# EAGLE schematic LiPo Drop Charger (EAGLE 6.4)
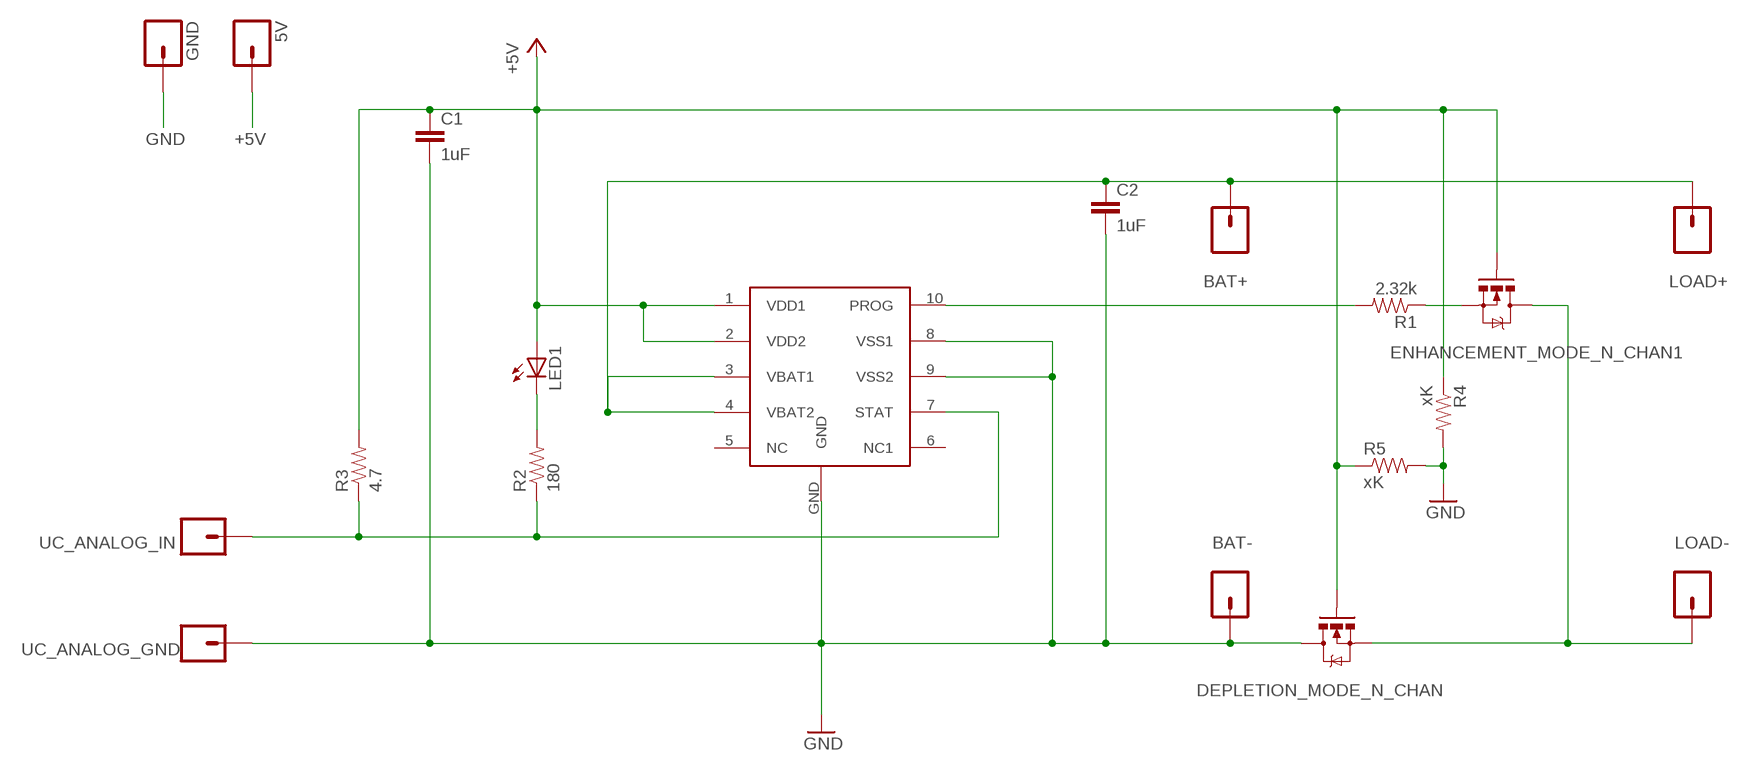
[diagram p0: schematic, sheet 1]

## Parts
5V  M01PTH  [1X01]
BAT+  M01PTH  [1X01]
BAT-  M01PTH  [1X01]
C1  1uF  CAP0805  [0805]
C2  1uF  CAP0805  [0805]
DEPLETION_MODE_N_CHAN  MOSFET-NCHANNELSMD  [SOT23-3]
ENHANCEMENT_MODE_N_CHAN1  MOSFET-NCHANNELSMD  [SOT23-3]
GND  M01PTH  [1X01]
LED1  LED0603  [LED-0603]
LOAD+  M01PTH  [1X01]
LOAD-  M01PTH  [1X01]
R1  2.32k  RESISTOR0805-RES  [0805]
R2  180  RESISTOR0805-RES  [0805]
R3  4.7  RESISTOR0805-RES  [0805]
R4  xK  RESISTOR0805-RES  [0805]
R5  xK  RESISTOR0805-RES  [0805]
U$1  MCP73213  [DFN10_3X3MM]
UC_ANALOG_GND  M01PTH  [1X01]
UC_ANALOG_IN  M01PTH  [1X01]

## Nets
+5V: 5V.1 C1.1 DEPLETION_MODE_N_CHAN.1(G) ENHANCEMENT_MODE_N_CHAN1.1(G) LED1.A R3.2 R4.1 R5.1 U$1.1(VDD1) U$1.2(VDD2)
GND: BAT-.1 C1.2 C2.2 DEPLETION_MODE_N_CHAN.3(D) GND.1 R4.2 R5.2 U$1.8(VSS1) U$1.9(VSS2) U$1.GND UC_ANALOG_GND.1
N$1: LED1.C R2.2
N$2: R2.1 R3.1 U$1.7(STAT) UC_ANALOG_IN.1
N$3: BAT+.1 C2.1 LOAD+.1 U$1.3(VBAT1) U$1.4(VBAT2)
N$4: DEPLETION_MODE_N_CHAN.2(S) ENHANCEMENT_MODE_N_CHAN1.3(D) LOAD-.1
N$5: R1.2 U$1.10(PROG)
N$6: ENHANCEMENT_MODE_N_CHAN1.2(S) R1.1
Unconnected: U$1.5(NC) U$1.6(NC1)

## Library data of the parts
5V BAT+ BAT- GND LOAD+ LOAD- UC_ANALOG_GND UC_ANALOG_IN = SparkFun:M01: Header 1 Standard 1-pin 0.1" header. Use with straight break away headers (SKU : PRT-00116), right angle break away headers (PRT-00553), swiss pins (PRT-00743), machine pins (PRT-00117), and female headers (PRT-00115).
C1 C2 = SparkFun:CAP: Capacitor Standard 0603 ceramic capacitor, and 0.1" leaded capacitor.
DEPLETION_MODE_N_CHAN ENHANCEMENT_MODE_N_CHAN1 = SparkFun:MOSFET-NCHANNEL
LED1 = SparkFun:LED: LEDs Standard schematic elements and footprints for 5mm, 3mm, 1206, and 0603 sized LEDs. 5mm - Spark Fun Electronics SKU : COM-00529 (and others)
R1-R5 = SparkFun:RESISTOR: Resistor Basic schematic elements and footprints for 0603, 1206, and PTH resistors.
U$1 = microbuilder:MCP73213